# Altium schematic sheet TLC59581.SchDoc
size A4
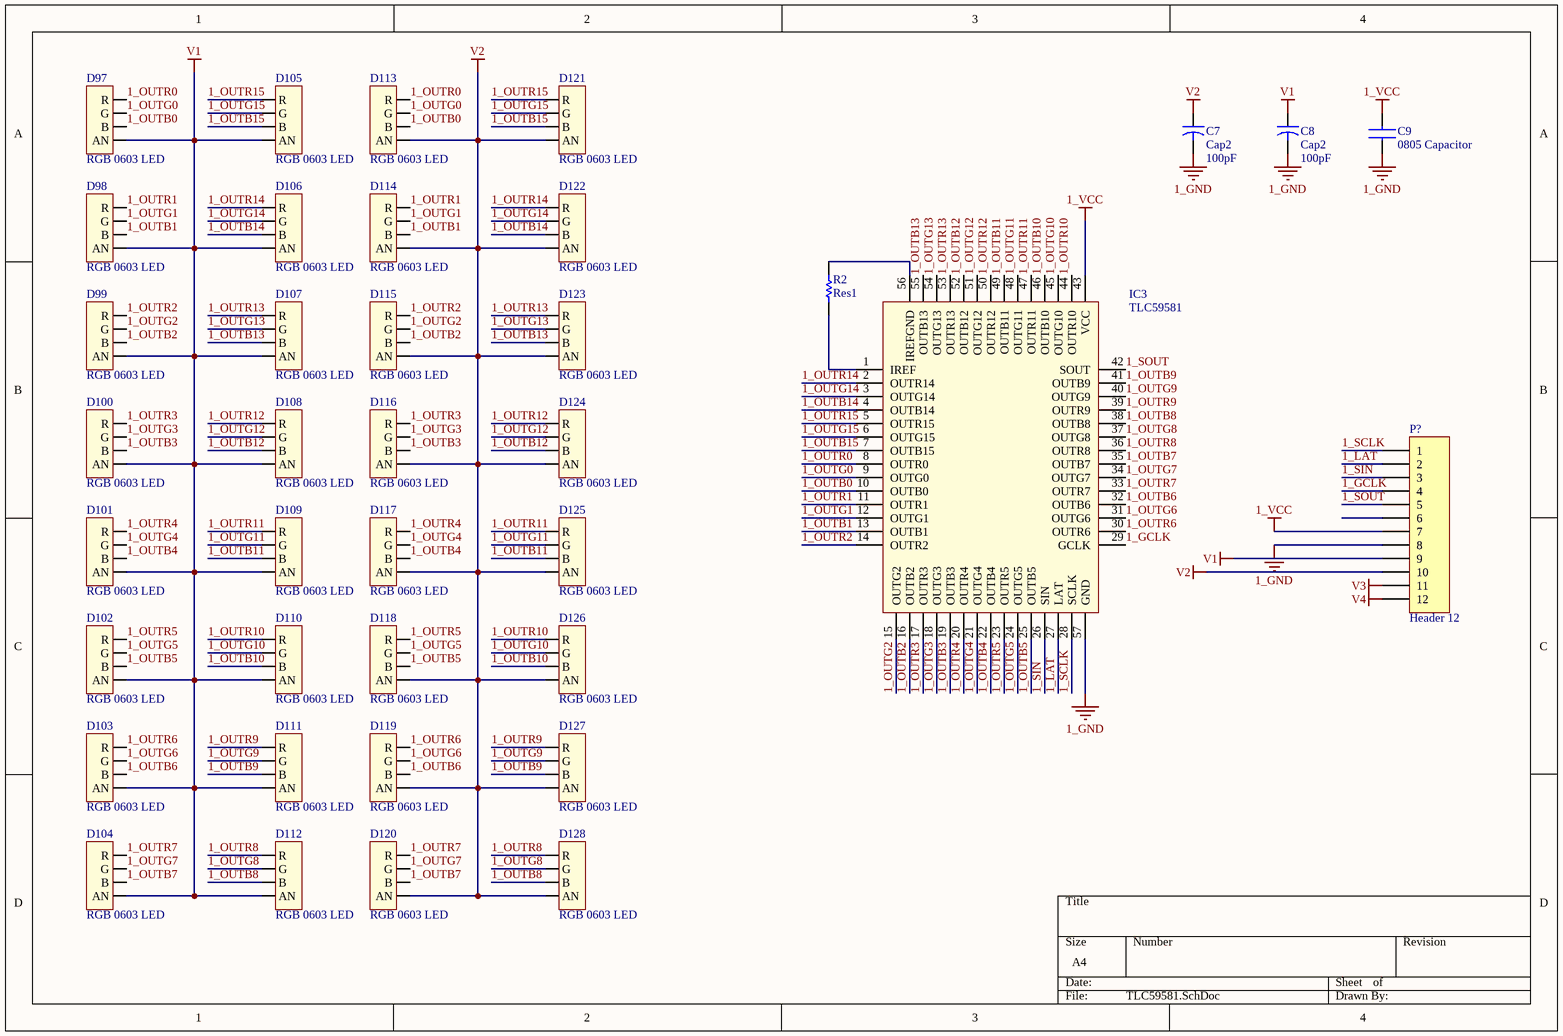
[diagram p0: TLC59581.SchDoc]

## Parts
C7  Cap2  value 100pF  [CAPR5-4X5]
C8  Cap2  value 100pF  [CAPR5-4X5]
C9  0805 Capacitor  [0805 Capacitor]
D97  RGB 0603 LED  [RGB LED]
D98  RGB 0603 LED  [RGB LED]
D99  RGB 0603 LED  [RGB LED]
D100  RGB 0603 LED  [RGB LED]
D101  RGB 0603 LED  [RGB LED]
D102  RGB 0603 LED  [RGB LED]
D103  RGB 0603 LED  [RGB LED]
D104  RGB 0603 LED  [RGB LED]
D105  RGB 0603 LED  [RGB LED]
D106  RGB 0603 LED  [RGB LED]
D107  RGB 0603 LED  [RGB LED]
D108  RGB 0603 LED  [RGB LED]
D109  RGB 0603 LED  [RGB LED]
D110  RGB 0603 LED  [RGB LED]
D111  RGB 0603 LED  [RGB LED]
D112  RGB 0603 LED  [RGB LED]
D113  RGB 0603 LED  [RGB LED]
D114  RGB 0603 LED  [RGB LED]
D115  RGB 0603 LED  [RGB LED]
D116  RGB 0603 LED  [RGB LED]
D117  RGB 0603 LED  [RGB LED]
D118  RGB 0603 LED  [RGB LED]
D119  RGB 0603 LED  [RGB LED]
D120  RGB 0603 LED  [RGB LED]
D121  RGB 0603 LED  [RGB LED]
D122  RGB 0603 LED  [RGB LED]
D123  RGB 0603 LED  [RGB LED]
D124  RGB 0603 LED  [RGB LED]
D125  RGB 0603 LED  [RGB LED]
D126  RGB 0603 LED  [RGB LED]
D127  RGB 0603 LED  [RGB LED]
D128  RGB 0603 LED  [RGB LED]
IC3  TLC59581  [TLC59581]
P?  Header 12  [HDR1X12]
R2  Res1  [AXIAL-0.3]

## Nets
1_GND: C7.2 C8.2 C9.1 IC3.57(GND) P?.8
1_VCC: C9.2 IC3.43(VCC) P?.7
V1: C8.1 D97.4(AN) D98.4(AN) D99.4(AN) D100.4(AN) D101.4(AN) D102.4(AN) D103.4(AN) D104.4(AN) D105.4(AN) D106.4(AN) D107.4(AN) D108.4(AN) D109.4(AN) D110.4(AN) D111.4(AN) D112.4(AN) P?.9
V2: C7.1 D113.4(AN) D114.4(AN) D115.4(AN) D116.4(AN) D117.4(AN) D118.4(AN) D119.4(AN) D120.4(AN) D121.4(AN) D122.4(AN) D123.4(AN) D124.4(AN) D125.4(AN) D126.4(AN) D127.4(AN) D128.4(AN) P?.10
V3: P?.11
V4: P?.12
1_GCLK: IC3.29(GCLK) P?.4
1_LAT: IC3.27(LAT) P?.2
1_OUTB0: D97.3(B) D113.3(B) IC3.10(OUTB0)
1_OUTB1: D98.3(B) D114.3(B) IC3.13(OUTB1)
1_OUTB2: D99.3(B) D115.3(B) IC3.16(OUTB2)
1_OUTB3: D100.3(B) D116.3(B) IC3.19(OUTB3)
1_OUTB4: D101.3(B) D117.3(B) IC3.22(OUTB4)
1_OUTB5: D102.3(B) D118.3(B) IC3.25(OUTB5)
1_OUTB6: D103.3(B) D119.3(B) IC3.32(OUTB6)
1_OUTB7: D104.3(B) D120.3(B) IC3.35(OUTB7)
1_OUTB8: D112.3(B) D128.3(B) IC3.38(OUTB8)
1_OUTB9: D111.3(B) D127.3(B) IC3.41(OUTB9)
1_OUTB10: D110.3(B) D126.3(B) IC3.46(OUTB10)
1_OUTB11: D109.3(B) D125.3(B) IC3.49(OUTB11)
1_OUTB12: D108.3(B) D124.3(B) IC3.52(OUTB12)
1_OUTB13: D107.3(B) D123.3(B) IC3.55(OUTB13)
1_OUTB14: D106.3(B) D122.3(B) IC3.4(OUTB14)
1_OUTB15: D105.3(B) D121.3(B) IC3.7(OUTB15)
1_OUTG0: D97.2(G) D113.2(G) IC3.9(OUTG0)
1_OUTG1: D98.2(G) D114.2(G) IC3.12(OUTG1)
1_OUTG2: D99.2(G) D115.2(G) IC3.15(OUTG2)
1_OUTG3: D100.2(G) D116.2(G) IC3.18(OUTG3)
1_OUTG4: D101.2(G) D117.2(G) IC3.21(OUTG4)
1_OUTG5: D102.2(G) D118.2(G) IC3.24(OUTG5)
1_OUTG6: D103.2(G) D119.2(G) IC3.31(OUTG6)
1_OUTG7: D104.2(G) D120.2(G) IC3.34(OUTG7)
1_OUTG8: D112.2(G) D128.2(G) IC3.37(OUTG8)
1_OUTG9: D111.2(G) D127.2(G) IC3.40(OUTG9)
1_OUTG10: D110.2(G) D126.2(G) IC3.45(OUTG10)
1_OUTG11: D109.2(G) D125.2(G) IC3.48(OUTG11)
1_OUTG12: D108.2(G) D124.2(G) IC3.51(OUTG12)
1_OUTG13: D107.2(G) D123.2(G) IC3.54(OUTG13)
1_OUTG14: D106.2(G) D122.2(G) IC3.3(OUTG14)
1_OUTG15: D105.2(G) D121.2(G) IC3.6(OUTG15)
1_OUTR0: D97.1(R) D113.1(R) IC3.8(OUTR0)
1_OUTR1: D98.1(R) D114.1(R) IC3.11(OUTR1)
1_OUTR2: D99.1(R) D115.1(R) IC3.14(OUTR2)
1_OUTR3: D100.1(R) D116.1(R) IC3.17(OUTR3)
1_OUTR4: D101.1(R) D117.1(R) IC3.20(OUTR4)
1_OUTR5: D102.1(R) D118.1(R) IC3.23(OUTR5)
1_OUTR6: D103.1(R) D119.1(R) IC3.30(OUTR6)
1_OUTR7: D104.1(R) D120.1(R) IC3.33(OUTR7)
1_OUTR8: D112.1(R) D128.1(R) IC3.36(OUTR8)
1_OUTR9: D111.1(R) D127.1(R) IC3.39(OUTR9)
1_OUTR10: D110.1(R) D126.1(R) IC3.44(OUTR10)
1_OUTR11: D109.1(R) D125.1(R) IC3.47(OUTR11)
1_OUTR12: D108.1(R) D124.1(R) IC3.50(OUTR12)
1_OUTR13: D107.1(R) D123.1(R) IC3.53(OUTR13)
1_OUTR14: D106.1(R) D122.1(R) IC3.2(OUTR14)
1_OUTR15: D105.1(R) D121.1(R) IC3.5(OUTR15)
1_SCLK: IC3.28(SCLK) P?.1
1_SIN: IC3.26(SIN) P?.3
1_SOUT: IC3.42(SOUT) P?.5
NetIC3_1: IC3.1(IREF) R2.1
NetIC3_56: IC3.56(IREFGND) R2.2

Not connected (* = marked no-connect by the designer): P? 6

## Library data of the parts
C7 C8 = Cap2: Capacitor; Published: 23-Sep-2002; PackageReference: CAPR5-4X5; Publisher: Altium Limited; PackageDescription: Capacitor; 2 Leads
P? = Header 12: Header, 12-Pin; LatestRevisionDate: 17-Jul-2002; LatestRevisionNote: Re-released for DXP Platform.; Publisher: Altium Limited
R2 = Res1: Resistor; Published: 8-Jun-2000; LatestRevisionDate: 17-Jul-2002; LatestRevisionNote: Re-released for DXP Platform.; PackageReference: AXIAL-0.3; Publisher: Altium Limited; PackageDescription: Axial Device, Thru-Hole; 2 Leads; 0.3 in Pin Spacing